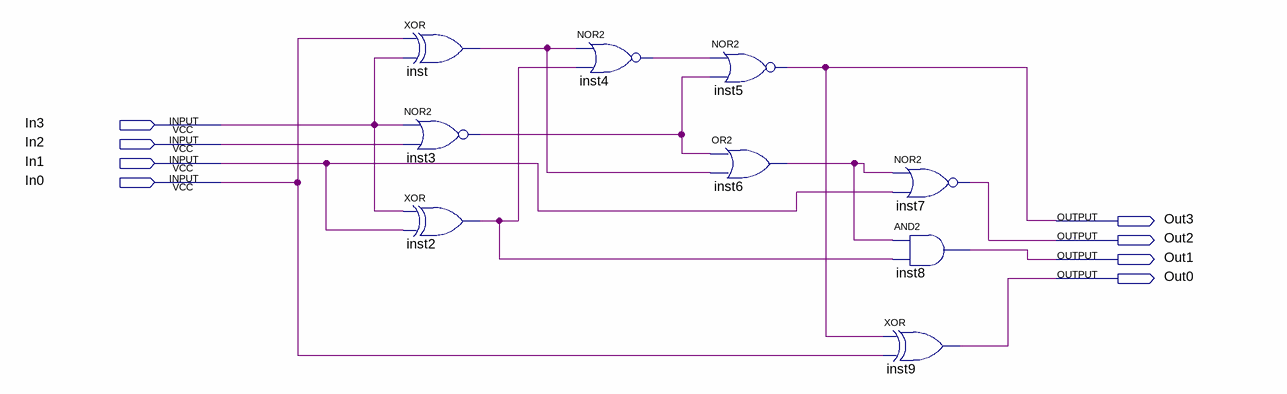
[diagram p0: schematic sheet]
// Quartus schematic dabble.bdf as structural Verilog: 9 symbols, 8 pins
module dabble (
  input  In3,
  input  In2,
  input  In1,
  input  In0,
  output Out3,
  output Out2,
  output Out1,
  output Out0
);

  wire inst2_out, inst3_out, inst4_out, inst6_out, inst_out;

  xor inst (inst_out, In0, In3);
  nor inst3 (inst3_out, In3, In2);
  xor inst2 (inst2_out, In3, In1);
  nor inst4 (inst4_out, inst_out, inst2_out);
  nor inst5 (Out3, inst4_out, inst3_out);
  or inst6 (inst6_out, inst3_out, inst_out);
  nor inst7 (Out2, inst6_out, In1);
  and inst8 (Out1, inst6_out, inst2_out);
  xor inst9 (Out0, Out3, In0);
endmodule
